# Altium schematic sheet 00_POWER.SchDoc: SENSEI Base Board - Power
size A3; DrawnBy: Sebastian Frey; Organization: Integrated Systems Laboratory; DocumentNumber: 1; Revision: v1.0; SheetNumber: 1; SheetTotal: 12
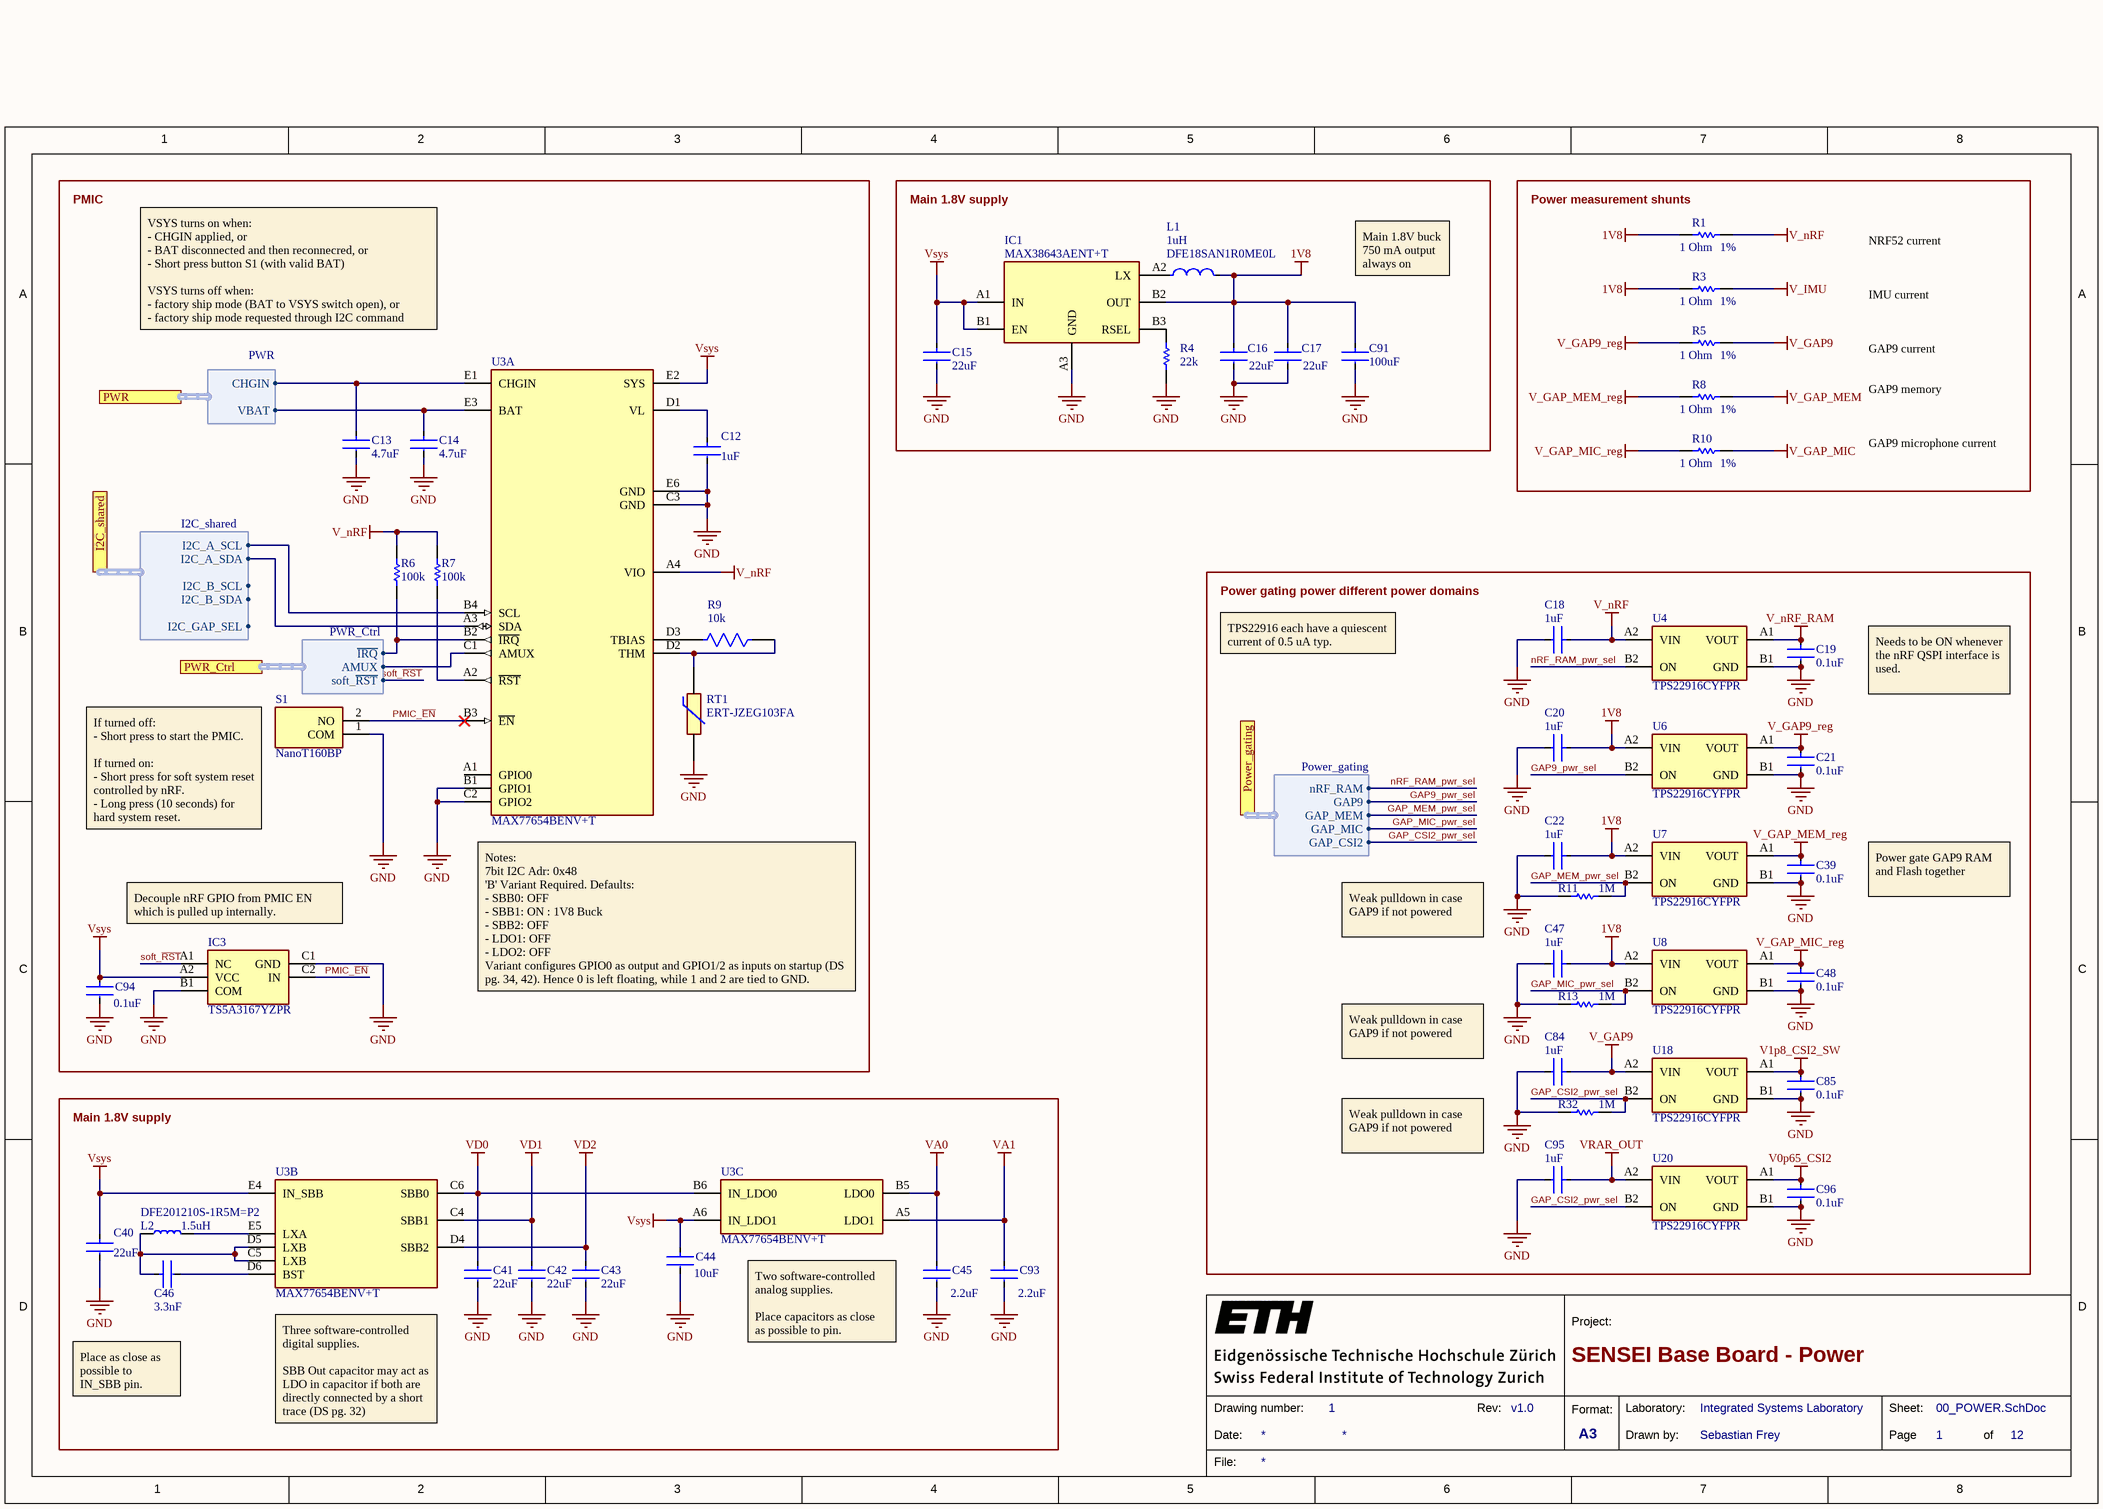
[diagram p0: 00_POWER.SchDoc]

## Parts
C12  Capacitance: 1uF  [FP-CL03-IPC_B]  (hidden comment: CL03A105KP3NSNC)
C13  Capacitance: 4.7uF  [FP-C1005-050-0_15-IPC_C]  (hidden comment: C1005X5R0J475K050BC)
C14  Capacitance: 4.7uF  [FP-C1005-050-0_15-IPC_C]  (hidden comment: C1005X5R0J475K050BC)
C15  Capacitance: 22uF  [FP-CL746-IPC_C]  (hidden comment: CL05A226MQ5QUNC)
C16  Capacitance: 22uF  [FP-CL746-IPC_C]  (hidden comment: CL05A226MQ5QUNC)
C17  Capacitance: 22uF  [FP-CL746-IPC_C]  (hidden comment: CL05A226MQ5QUNC)
C18  Capacitance: 1uF  [FP-CL03-IPC_B]  (hidden comment: CL03A105KP3NSNC)
C19  Capacitance: 0.1uF  [FP-GRM033-0_03-IPC_B]  (hidden comment: GRM033Z71C104KE14D)
C20  Capacitance: 1uF  [FP-CL03-IPC_B]  (hidden comment: CL03A105KP3NSNC)
C21  Capacitance: 0.1uF  [FP-GRM033-0_03-IPC_B]  (hidden comment: GRM033Z71C104KE14D)
C22  Capacitance: 1uF  [FP-CL03-IPC_B]  (hidden comment: CL03A105KP3NSNC)
C39  Capacitance: 0.1uF  [FP-GRM033-0_03-IPC_B]  (hidden comment: GRM033Z71C104KE14D)
C40  Capacitance: 22uF  [FP-CL746-IPC_C]  (hidden comment: CL05A226MQ5QUNC)
C41  Capacitance: 22uF  [FP-CL746-IPC_C]  (hidden comment: CL05A226MQ5QUNC)
C42  Capacitance: 22uF  [FP-CL746-IPC_C]  (hidden comment: CL05A226MQ5QUNC)
C43  Capacitance: 22uF  [FP-CL746-IPC_C]  (hidden comment: CL05A226MQ5QUNC)
C44  Capacitance: 10uF  [FP-CL05A106MP5NUNC-IPC_C]  (hidden comment: CL05A106MP5NUNC)
C45  Capacitance: 2.2uF  [FP-GRM155-0_2-IPC_C]  (hidden comment: GRM155C70J225KE11D)
C46  Capacitance: 3.3nF  [FP-GRM033-0_03-IPC_A]  (hidden comment: GRM033R71E332KA12D)
C47  Capacitance: 1uF  [FP-CL03-IPC_B]  (hidden comment: CL03A105KP3NSNC)
C48  Capacitance: 0.1uF  [FP-GRM033-0_03-IPC_B]  (hidden comment: GRM033Z71C104KE14D)
C84  Capacitance: 1uF  [FP-CL03-IPC_B]  (hidden comment: CL03A105KP3NSNC)
C85  Capacitance: 0.1uF  [FP-GRM033-0_03-IPC_B]  (hidden comment: GRM033Z71C104KE14D)
C91  Capacitance: 100uF  [FP-GRM21B-0_2-e0_2_0_7-MFG]  (hidden comment: GRM21BR60G107ME11L)
C93  Capacitance: 2.2uF  [FP-GRM155-0_2-IPC_C]  (hidden comment: GRM155C70J225KE11D)
C94  Capacitance: 0.1uF  [FP-GRM033-0_03-IPC_B]  (hidden comment: GRM033Z71C104KE14D)
C95  Capacitance: 1uF  [FP-CL03-IPC_B]  (hidden comment: CL03A105KP3NSNC)
C96  Capacitance: 0.1uF  [FP-GRM033-0_03-IPC_B]  (hidden comment: GRM033Z71C104KE14D)
IC1  MAX38643AENT+T  [BGA6C40P3X2_142X89X50]
IC3  TS5A3167YZPR  [BGA5C50P2X3_89X139X50]
L1  DFE18SAN1R0ME0L  Inductance: 1uH  [FP-DFE18SAN_E0-MFG]
L2  DFE201210S-1R5M=P2  Inductance: 1.5uH  [IND_0805_DFE201210S]
R1  value 1 Ohm  Tolerance: 1%  [RESC1005X40X25LL05T10]  (hidden comment: CRCW04021R00FKEDHP)
R3  value 1 Ohm  Tolerance: 1%  [RESC1005X40X25LL05T10]  (hidden comment: CRCW04021R00FKEDHP)
R4  Resistance: 22k  [RESC0603X26X15LL03T05]  (hidden comment: RK73H1HTTC2202F)
R5  value 1 Ohm  Tolerance: 1%  [RESC1005X40X25LL05T10]  (hidden comment: CRCW04021R00FKEDHP)
R6  value 100k  [RESC0201(0603)_L]  (hidden comment: RC0201FR-07100KL)
R7  value 100k  [RESC0201(0603)_L]  (hidden comment: RC0201FR-07100KL)
R8  value 1 Ohm  Tolerance: 1%  [RESC1005X40X25LL05T10]  (hidden comment: CRCW04021R00FKEDHP)
R9  Resistance: 10k  [FP-RMCF0201-IPC_C]  (hidden comment: RMCF0201FT10K0)
R10  value 1 Ohm  Tolerance: 1%  [RESC1005X40X25LL05T10]  (hidden comment: CRCW04021R00FKEDHP)
R11  value 1M  [RESC0201(0603)_L]  (hidden comment: ERJ-1GNJ105C)
R13  value 1M  [RESC0201(0603)_L]  (hidden comment: ERJ-1GNJ105C)
R32  value 1M  [RESC0201(0603)_L]  (hidden comment: ERJ-1GNJ105C)
RT1  ERT-JZEG103FA  [ERTJZEG103FA]
S1  NanoT160BP  [NanoT160BP]
U3  MAX77654BENV+T  [WLP_30_MAX77654]  (parts A,B,C of 3)
U4  TPS22916CYFPR  [BGA4C40P2X2_78X78X50]
U6  TPS22916CYFPR  [BGA4C40P2X2_78X78X50]
U7  TPS22916CYFPR  [BGA4C40P2X2_78X78X50]
U8  TPS22916CYFPR  [BGA4C40P2X2_78X78X50]
U18  TPS22916CYFPR  [BGA4C40P2X2_78X78X50]
U20  TPS22916CYFPR  [BGA4C40P2X2_78X78X50]

## Blocks framed on the sheet
PMIC: C12-C14 C94 IC3 R6 R7 R9 RT1 S1 U3
Main 1.8V supply: C15-C17 C91 IC1 L1 R4
Power measurement shunts: R1 R3 R5 R8 R10
Power gating power different power domains: C18-C22 C39 C47 C48 C84 C85 C95 C96 R11 R13 R32 U4 U6-U8 U18 U20
Main 1.8V supply: C40-C46 C93 L2 U3

## Ports
I2C_shared (harness I2C_shared), Power_gating (harness Power_gating), PWR (harness PWR), PWR_Ctrl (harness PWR_Ctrl)

## Harnesses
PWR: CHGIN, VBAT
PWR_Ctrl: ~{IRQ}, AMUX, soft_~{RST}
Power_gating: nRF_RAM, GAP9, GAP_MEM, GAP_MIC, GAP_CSI2
I2C_shared: I2C_A_SCL, I2C_A_SDA, I2C_B_SCL, I2C_B_SDA, I2C_GAP_SEL

## Nets
1V8: C16.1 C17.1 C20.1 C22.1 C47.1 C91.1 IC1.B2(OUT) L1.2 R1.1 R3.1 U6.A2(VIN) U7.A2(VIN) U8.A2(VIN)
GND: C12.2 C13.2 C14.2 C15.2 C16.2 C17.2 C18.2 C19.2 C20.2 C21.2 C22.2 C39.2 C40.2 C41.2 C42.2 C43.2 C44.2 C45.2 C47.2 C48.2 C84.2 C85.2 C91.2 C93.2 C94.2 C95.2 C96.2 IC1.A3(GND) IC3.B1(COM) IC3.C1(GND) R4.1 R11.1 R13.1 R32.1 RT1.2 S1.1(COM) U3.B1(GPIO1) U3.C2(GPIO2) U3.C3(GND) U3.E6(GND) U4.B1(GND) U6.B1(GND) U7.B1(GND) U8.B1(GND) U18.B1(GND) U20.B1(GND)
V0p65_CSI2: C96.1 U20.A1(VOUT)
V1p8_CSI2_SW: C85.1 U18.A1(VOUT)
V_GAP9: C84.1 R5.2 U18.A2(VIN)
V_GAP9_reg: C21.1 R5.1 U6.A1(VOUT)
V_GAP_MEM: R8.2
V_GAP_MEM_reg: C39.1 R8.1 U7.A1(VOUT)
V_GAP_MIC: R10.2
V_GAP_MIC_reg: C48.1 R10.1 U8.A1(VOUT)
V_IMU: R3.2
V_nRF: C18.1 R1.2 R6.2 R7.2 U3.A4(VIO) U4.A2(VIN)
V_nRF_RAM: C19.1 U4.A1(VOUT)
VA0: C45.1 U3.B5(LDO0)
VA1: C93.1 U3.A5(LDO1)
VD0: C41.1 U3.B6(IN_LDO0) U3.C6(SBB0)
VD1: C42.1 U3.C4(SBB1)
VD2: C43.1 U3.D4(SBB2)
VRAR_OUT: C95.1 U20.A2(VIN)
Vsys: C15.1 C40.1 C44.1 C94.1 IC1.A1(IN) IC1.B1(EN) IC3.A2(VCC) U3.A6(IN_LDO1) U3.E2(SYS) U3.E4(IN_SBB)
GAP9_pwr_sel: U6.B2(ON) ; port Power_gating.GAP9
GAP_CSI2_pwr_sel: R32.2 U18.B2(ON) U20.B2(ON) ; port Power_gating.GAP_CSI2
GAP_MEM_pwr_sel: R11.2 U7.B2(ON) ; port Power_gating.GAP_MEM
GAP_MIC_pwr_sel: R13.2 U8.B2(ON) ; port Power_gating.GAP_MIC
nRF_RAM_pwr_sel: U4.B2(ON) ; port Power_gating.nRF_RAM
PMIC_~{EN}: IC3.C2(IN) S1.2(NO) U3.B3(~{EN})
soft_~{RST}: IC3.A1(NC) ; port PWR_Ctrl.soft_~{RST}
NetC12_1: C12.1 U3.D1(VL)
NetC13_1: C13.1 U3.E1(CHGIN) ; port PWR.CHGIN
NetC14_1: C14.1 U3.E3(BAT) ; port PWR.VBAT
NetC46_1: C46.1 L2.1 U3.C5(LXB) U3.D5(LXB)
NetC46_2: C46.2 U3.D6(BST)
NetIC1_A2: IC1.A2(LX) L1.1
NetIC1_B3: IC1.B3(RSEL) R4.2
NetL2_2: L2.2 U3.E5(LXA)
NetR6_1: R6.1 U3.B2(~{IRQ}) ; port PWR_Ctrl.~{IRQ}
NetR7_1: R7.1 U3.A2(~{RST})
NetR9_1: R9.1 RT1.1 U3.D2(THM)
NetR9_2: R9.2 U3.D3(TBIAS)
NetU3_A3: U3.A3(SDA) ; port I2C_shared.I2C_A_SDA
NetU3_B4: U3.B4(SCL) ; port I2C_shared.I2C_A_SCL
NetU3_C1: U3.C1(AMUX) ; port PWR_Ctrl.AMUX

Not connected (* = marked no-connect by the designer): U3 A1(GPIO0)

## Notes on the sheet
- NRF52 current
- Main 1.8V buck
  750 mA output
  always on
- IMU current
- VSYS turns on when:
  - CHGIN applied, or
  - BAT disconnected and then reconnecred, or
  - Short press button S1 (with valid BAT)
  VSYS turns off when:
  - factory ship mode (BAT to VSYS switch open), or
  - factory ship mode requested through I2C command
- GAP9 current
- GAP9 memory current
- GAP9 microphone current
- TPS22916 each have a quiescent current of 0.5 uA typ.
- Needs to be ON whenever the nRF QSPI interface is used.
- If turned off:
  - Short press to start the PMIC.
  If turned on:
  - Short press for soft system reset controlled by nRF.
  - Long press (10 seconds) for hard system reset.
- (near IC3) Decouple nRF GPIO from PMIC EN which is pulled up internally.
- Power gate GAP9 RAM and Flash together
- (near U3) Notes:
  7bit I2C Adr: 0x48
  'B' Variant Required. Defaults:
  - SBB0: OFF
  - SBB1: ON : 1V8 Buck
  - SBB2: OFF
  - LDO1: OFF
  - LDO2: OFF
  Variant configures GPIO0 as output and GPIO1/2 as inputs on startup (DS pg. 34, 42). Hence 0 is left floating, while 1 and 2 are tied to GND.
- Weak pulldown in case GAP9 if not powered
- Place as close as
  possible to
  IN_SBB pin.
- Two software-controlled
  analog supplies.
  Place capacitors as close
  as possible to pin.
- Three software-controlled
  digital supplies.
  SBB Out capacitor may act as
  LDO in capacitor if both are
  directly connected by a short
  trace (DS pg. 32)
- 1
- 2
- 3
- 4
- 5
- 6
- 7
- 8
- A
- B
- C
- D
- Project:
- Date:
- Drawing number:
- Rev:
- Format:
- A3
- Drawn by:
- Laboratory:
- Page
- Sheet:
- of
- File:

## Library data of the parts
C12 C18 C20 C22 C47 C84 C95 = CMP-13271-003594-1: Cap Ceramic 1uF 10V X5R ±10% Pad SMD 0201 +85°C T/R; Min Operating Temperature: -55°C; Mount: Surface Mount; Packaging: Cut Tape; Width: 0.012inch; Tolerance: 10%; Case Code (Imperial): 0201; Thickness: 0.013inch; Length: 0.024inch; Case/Package: 0201; Max Operating Temperature: 85°C; Voltage Rating: 10V; Case Code (Metric): 0603
C13 C14 = CMP-2000-05437-2: CAP CER 4.7UF 6.3V X5R 0402; Tolerance: 10%; Dielectric Material: Ceramic; Voltage: 6.3V; Depth: 0.5mm; Height: 0.5mm; Length: 1mm; Termination: SMD/SMT; RoHS Compliant: Yes; Series: C; Case/Package: 0402; Dielectric: X5R; Lead Free: Lead Free; Mount: Surface Mount; Max Operating Temperature: 85°C; Min Operating Temperature: -55°C
C15-C17 C40-C43 = CMP-13271-000286-1: Cap Ceramic 22uF 6.3V X5R ±20% SMD 0402 +85°C Paper T/R; Case Code (Imperial): 0402; Tolerance: 20%; Width: 0.02inch; Packaging: Tape and Reel; Case/Package: 0402; Min Operating Temperature: -55°C; Max Operating Temperature: 85°C; Voltage Rating: 6.3V; Thickness: 0.022inch; Mount: Surface Mount; Length: 0.039inch; Case Code (Metric): 1005
C19 C21 C39 C48 C85 C94 C96 = CMP-06035-035508-1: Chip Multilayer Ceramic Capacitors for General Purpose, 0201, 0.10uF, X7R, 15%, 10%, 16V; Case/Package: 0201
C44 = CMP-13271-000002-1: CAP CER 10UF 10V X5R 0402; Manufacturer: Samsung; Temperature Coefficient: 15%; Tolerance: 20%; Material: Ceramic; Octopart: https://octopart.com/cl05a106mp5nunc-samsung-22457395; Voltage Rating: 10V; RoHS: TRUE; Value: 10uF; Height: 0.7mm; Digikey Description: CAP CER 10UF 10V X5R 0402; Automotive: No; Package: CL05A106MP5NUNC; Device Class L1: Passive Components; Temperature Range High: +85°C; ComponentLink2Description: Datasheet; Device Class L2: Capacitors; Temperature Characteristic: X5R; Manufacturer Part Number: CL05A106MP5NUNC; Temperature: -55°C to +85°C; ComponentLink2URL: http://www.samsungsem.com/kr/support/product-search/mlcc/__icsFiles/afieldfile/2019/05/10/19-CL05A106MP5NUNC.pdf; Device Class L3: Ceramic Capacitors; Category: Cap; Temperature Range Low: -55°C; Ipc Land Pattern Name: CAPC10050X50; Lead Free: Yes
C45 C93 = CMP-06035-014902-1: Chip Multilayer Ceramic Capacitors for General Purpose, 0402, 2.2uF, X7S, 22%, 10%, 6.3V; Dielectric: X7S; Case Code (Metric): 1005; Case/Package: 0402; Voltage Rating (DC): 6.3V; Length: 0.039inch; Max Operating Temperature: 125°C; Tolerance: 10%; Width: 0.02inch; Mount: Surface Mount; Packaging: Tape and Reel; Package Quantity: 10000; Voltage Rating: 6.3V; Resistor Type: Ceramic; Min Operating Temperature: -55°C; Case Code (Imperial): 0402; Termination: SMD/SMT; Weight: 0.000212oz; Height: 0.5mm; Thickness: 0.022inch
C46 = CMP-06035-035563-1: Chip Multilayer Ceramic Capacitors for General Purpose, 0201, 3300pF, X7R, 15%, 10%, 25V; Mount: Surface Mount; Voltage Rating: 25V; Max Operating Temperature: 125°C; Height: 0.3mm; Resistor Type: Ceramic; Case/Package: 0201; Case Code (Imperial): 0201; Min Operating Temperature: -55°C; Packaging: Tape and Reel; Weight: 1.2E-05oz; Thickness: 0.013inch; Voltage Rating (DC): 25V; Case Code (Metric): 0603; Package Quantity: 15000; Width: 0.012inch; Dielectric: X7R; Tolerance: 10%; Termination: SMD/SMT; Length: 0.024inch
C91 = CMP-06035-033356-1: Chip Multilayer Ceramic Capacitors for General Purpose, 0805, 100uF, X5R, 15%, 20%, 4V; Length: 0.079inch; Voltage Rating (DC): 4V; Min Operating Temperature: -55°C; Dielectric: X5R; Case Code (Metric): 2012; Case/Package: 0805; Voltage Rating: 4V; Width: 0.049inch; Case Code (Imperial): 0805; Mount: Surface Mount; Packaging: Tape and Reel; Thickness: 0.057inch; Tolerance: 20%; Max Operating Temperature: 85°C
IC1 = MAX38643AENT+: Integrated Circuit; Manufacturer_Name: Analog Devices; Datasheet Link: https://www.mouser.com/datasheet/2/256/MAX38640A-MAX38643B-1516623.pdf; Height: 0.5mm; Manufacturer_Part_Number: MAX38643AENT+; Mouser Part Number: 700-MAX38643AENT+; Mouser Price/Stock: https://www.mouser.co.uk/ProductDetail/Maxim-Integrated/MAX38643AENT%2b?qs=PzGy0jfpSMssjCGgbzOt4w%3D%3D
IC3 = TS5A3167YZPR: Integrated Circuit; Manufacturer_Name: Texas Instruments; Datasheet Link: http://www.ti.com/lit/gpn/ts5a3167; Height: 0.5mm; Manufacturer_Part_Number: TS5A3167YZPR; Mouser Part Number: 595-TS5A3167YZPR; Mouser Price/Stock: https://www.mouser.co.uk/ProductDetail/Texas-Instruments/TS5A3167YZPR/?qs=0O%2FZFlpUpJV2gM0iE3NeCQ%3D%3D; Arrow Part Number: TS5A3167YZPR; Arrow Price/Stock: https://www.arrow.com/en/products/ts5a3167yzpr/texas-instruments
L1 = CMP-06042-016331-1: FIXED IND 1UH 1.6A 144 MOHM SMD; Saturation Current: 2A; DC Resistance (DCR): 144mR; Shielding: Shielded; Core Material: Metal; Tolerance: 20%; Test Frequency: 1MHz; Mount: Surface Mount; Min Operating Temperature: -40°C; Current Rating: 1.6A; Case Code (Imperial): 0603; RoHS Compliant: Yes; Max Operating Temperature: 85°C; Case/Package: 0603; Packaging: Cut Tape; Case Code (Metric): 1608
L2 = L_0805_1.5uH_2A: L 1.5uH 2A 0805; Manufacturer: Murata; Supplier 1: Mouser; Manufacturer Part Number: DFE201210S-1R5M=P2; Supplier Part Number 1: 81-DFE201210S-1R5MP2
R1 R3 R5 R8 R10 = CMP-2002-03047-1: Manufacturer: Vishay Dale; Part Number: CRCW04021R00FKEDHP
R4 = CMP-2004-01604-1: Manufacturer: KOA Speer; Part Number: RK73H1HTTC2202F
R6 R7 = CMP-1010-00642-1: 100K 0.05W 1% 0201 (0603 Metric)  SMD; Case-EIA: 0201; Case-Metric: 0603; Technology: SMT; Power: 0.05 W; Tolerance: 1 %
R9 = CMP-26527-002755-1: RES 10K OHM 1% 1/20W 0201; Max Power Dissipation: 50mW; Temperature Coefficient: 200ppm/°C; Length: 0.024inch; Min Operating Temperature: -55°C; Width: 0.012inch; Contact Plating: Tin; Case/Package: 0201; Power Rating: 50mW; Packaging: Tape and Reel; Resistor Type: Thick Film; Case Code (Metric): 0603; Tolerance: 1%; Case Code (Imperial): 0201; Max Operating Temperature: 125°C; Height: 0.009inch; Mount: Surface Mount; Series: RMCF; RoHS Compliant: Yes; Number of Terminations: 2
R11 R13 R32 = CMP-1010-00146-1: 1M 0.05W 5% 0201 (0603 Metric)  SMD; Case-Metric: 0603; Case-EIA: 0201; Technology: SMT; Tolerance: 5 %; Power: 0.05 W
RT1 = ERT-JZEG103FA: Thermistor; Manufacturer_Name: Panasonic; Datasheet Link: https://industrial.panasonic.com/cdbs/www-data/pdf/AUA0000/AUA0000C8.pdf; Height: 0.33mm; Manufacturer_Part_Number: ERT-JZEG103FA; Mouser Part Number: 667-ERT-JZEG103FA; Mouser Price/Stock: https://www.mouser.co.uk/ProductDetail/Panasonic/ERT-JZEG103FA?qs=8rMlxy%252BA7jnazXT5AW8efg%3D%3D; Arrow Part Number: ERT-JZEG103FA; Arrow Price/Stock: https://www.arrow.com/en/products/ert-jzeg103fa/panasonic?region=nac
S1 = NanoT160BP: Switch; Manufacturer_Name: LITTELFUSE; Datasheet Link: https://www.ckswitches.com/media/2866/nanot.pdf; Height: 1mm; Manufacturer_Part_Number: NanoT160BP
U3 = MAX77654BENV+T: Buck-Boost Converter With LDO Regulator 5-OUT 30-Pin WLP T/R; Manufacturer: Maxim; Manufacturer Part Number: MAX77654BENV+T; Supplier 1: Mouser; Supplier Part Number 1: 700-MAX77654BENV+T
U4 U6-U8 U18 U20 = TPS22916CYFPR: Integrated Circuit; Manufacturer_Name: Texas Instruments; Datasheet Link: http://www.ti.com/lit/gpn/tps22916; Height: 0.5mm; Manufacturer_Part_Number: TPS22916CYFPR; Mouser Part Number: 595-TPS22916CYFPR; Mouser Price/Stock: https://www.mouser.co.uk/ProductDetail/Texas-Instruments/TPS22916CYFPR?qs=EU6FO9ffTweddKR4NsfVQg%3D%3D; Arrow Part Number: TPS22916CYFPR; Arrow Price/Stock: https://www.arrow.com/en/products/tps22916cyfpr/texas-instruments?region=nac